# Altium schematic sheet PART2_zener_stab.SchDoc
size A4
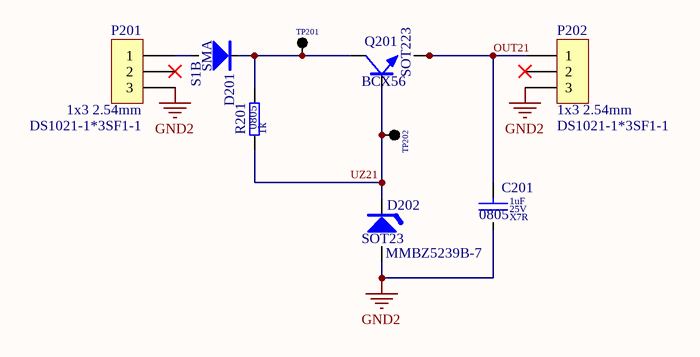
[diagram p0: PART2_zener_stab.SchDoc]

## Parts
C201  value 1uF  Dielectric: X7R  Voltage: 25V  SCH_Footprint: 0805  [C_0805_2012]  (hidden comment: Ceramic X7R)
D201  value S1B  SCH_Footprint: SMA  [SMA_DO-214AC]
D202  value MMBZ5239B-7  SCH_Footprint: SOT23  [D_SOT23_TO236_SC59]
P201  value DS1021-1*3SF1-1  SCH_Footprint: 1x3 2.54mm  [P_HEADER_1x3_2.54]  (hidden comment: Goldpin)
P202  value DS1021-1*3SF1-1  SCH_Footprint: 1x3 2.54mm  [P_HEADER_1x3_2.54]  (hidden comment: Goldpin)
Q201  SCH_Footprint: SOT223  [SOT-223_M]  (hidden comment: BCX56)
R201  value 1k  SCH_Footprint: 0805  [R_0805_2012]  (hidden comment: Resistor)
TP201  Single pin  [TP_1PIN]  (value not drawn)
TP202  Single pin  [TP_1PIN]  (value not drawn)

## Nets
GND2: C201.2 D202.2(A) P201.3 P202.3
OUT21: C201.1 P202.1 Q201.1(C) Q201.3(E)
UZ21: D202.1(K) Q201.4(B) R201.1 TP202.1(TP)
NetD201_1: D201.1 Q201.2(C) R201.2 TP201.1(TP)
NetD201_2: D201.2 P201.1

Not connected (* = marked no-connect by the designer): P201 2*; P202 2*

## Library data of the parts
C201 = C_1uF_25V_X7R_0805_10: Capacitor; Manufacturer: AVX; Manufacturer Part Number: 08053C105KAT2A; Tolerance (%): 10; Part Number: C_1uF_25V_X7R_0805_10; HelpURL: https://www.tme.eu/Document/667fe6e7748c0ed1675574c6bf64b751/AVX_X7R.pdf; Supplier 1: TME; Supplier Part Number 1: 08053C105KAT2A; Supplier 2: RS Components; Supplier Part Number 2: 1351396; Supplier 3: Farnell; Supplier Part Number 3: 1658877; Supplier 4: Mouser; Supplier Part Number 4: 581-08053C105KAT2A; Supplier 5: Digi-Key; Supplier Part Number 5: 478-5030-1-ND
D201 = D_S1B_1A_100V_SMA: Manufacturer: Vishay/General Semiconductor; Voltage: 100V; Current: 1A; Part Number: D_S1B_1A_100V_SMA; Manufacturer Part Number: S1B; Supplier 1: TME; Supplier 2: RS Components; Supplier 3: Farnell; Supplier 4: Mouser; Supplier Part Number 4: 821-S1B; Supplier 5: Digi-Key; Supplier Part Number 5: S1B/51GI
D202 = DZ_9V1_SOT23: Zener; Manufacturer: Diodes Inc; Voltage: 9.1V; Part Number: DZ_9V1_SOT23; Manufacturer Part Number: MMBZ5239B-7; Supplier 1: TME; Supplier 2: RS Components; Supplier 3: Farnell; Supplier 4: Mouser; Supplier 5: Digi-Key; Supplier Part Number 5: MMBZ5239B-FDICT-ND
P201 P202 = P_HEADER_1x3_2.54: Pin Header; Manufacturer: Connfly; Part Number: P_HEADER_1x3_2.54; Component Type: Standard; HelpURL: http://www.tme.eu/en/Document/cc301e58a5da78cb543a94b5a5b7f06a/DS1021.pdf; Manufacturer Part Number: DS1021-1*3SF1-1; Supplier 1: TME; Supplier Part Number 1: ZL201-03G; Supplier 2: RS Components; Supplier 3: Farnell; Supplier 4: Mouser; Supplier 5: Digi-Key
Q201 = QNP_BCX56: Manufacturer: Nexperia; Type: NPN; Voltage: 80V; Current: 1A; Part Number: QNP_BCX56; Value: BCX56; HelpURL: https://datasheet.octopart.com/BCX56-10%2C115-Nexperia-datasheet-78799842.pdf; Manufacturer Part Number: BCX56; Supplier 1: TME; Supplier 2: RS Components; Supplier Part Number 2: 725-8540; Supplier 3: Farnell; Supplier Part Number 3: 1757914; Supplier 4: Mouser; Supplier Part Number 4: 771-BCX56-10-T/R; Supplier 5: Digi-Key; Supplier Part Number 5: 1727-4318-1-ND-ND
R201 = R_1k_0805_1: Manufacturer: Royalohm; Manufacturer Part Number: HP05W3F1001T5E; Voltage: 150V; Power: 300mW; Tolerance: 1%; Part Number: R_1k_0805_1; HelpURL: https://www.tme.eu/pl/Document/63d5a2fbb689d2d511047d7cc8640cd8/chip_resistor_hp.pdf; Supplier 1: TME; Supplier Part Number 1: HP05-1K1%; Supplier 2: RS Components; Supplier 3: Farnell; Supplier 4: Mouser; Supplier 5: Digi-Key
TP201 TP202 = TP_1PIN: Testpoint; SCH_Footprint: Single; Part Number: TP_1PIN; Component Type: Standard; Supplier 1: TME; Supplier 2: RS Components; Supplier 3: Farnell; Supplier 4: Mouser; Supplier 5: Digi-Key